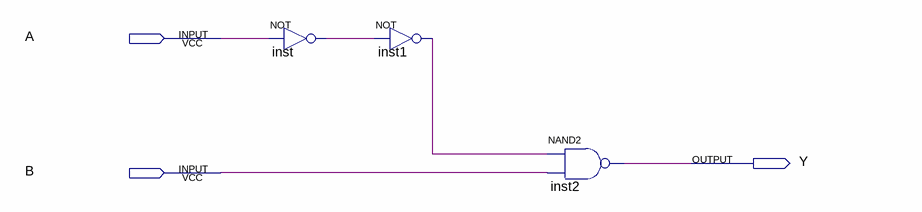
[diagram p0: schematic sheet]
// Quartus schematic MyTest.bdf as structural Verilog: 3 symbols, 3 pins
module MyTest (
  input  A,
  input  B,
  output Y
);

  wire inst1_out, inst_out;

  not inst (inst_out, A);
  not inst1 (inst1_out, inst_out);
  nand inst2 (Y, inst1_out, B);
endmodule
